# EAGLE design circuitcop (EAGLE 8.5.0)
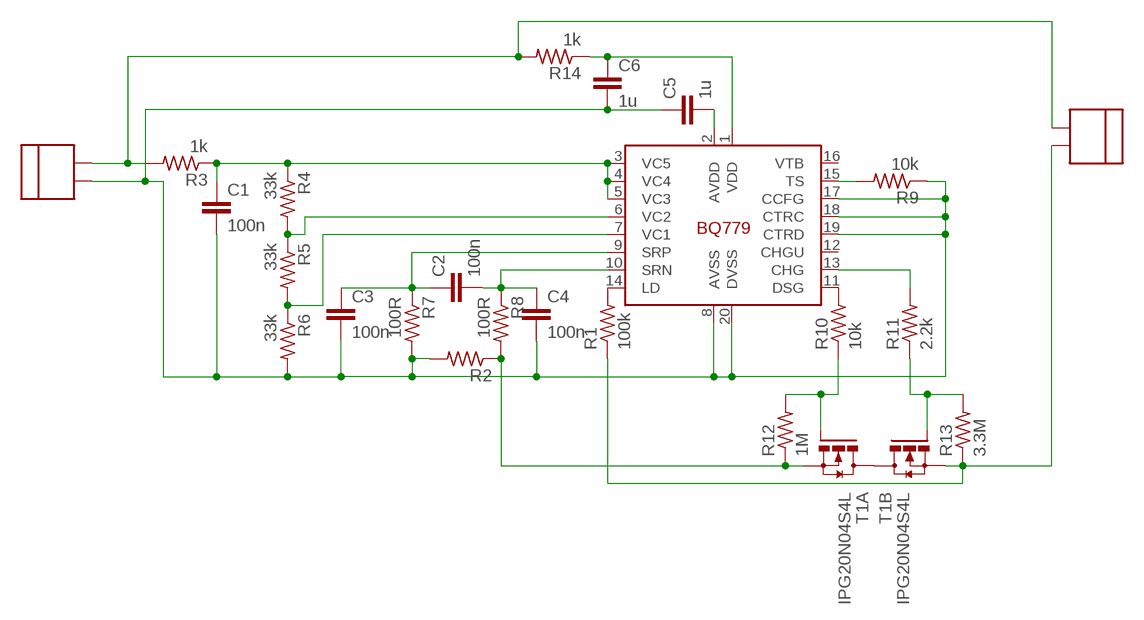
[diagram p0: schematic, sheet 1]

## Parts
C1  100n  C-EUC0805  [C0805]
C2  100n  C-EUC0805  [C0805]
C3  100n  C-EUC0805  [C0805]
C4  100n  C-EUC0805  [C0805]
C5  1u  C-EUC0805  [C0805]
C6  1u  C-EUC0805  [C0805]
R1  100k  R-US_R0805  [R0805]
R2  R-US_R1206  [R1206]
R3  1k  R-US_R0805  [R0805]
R4  33k  R-US_R0805  [R0805]
R5  33k  R-US_R0805  [R0805]
R6  33k  R-US_R0805  [R0805]
R7  100R  R-US_R0805  [R0805]
R8  100R  R-US_R0805  [R0805]
R9  10k  R-US_R0805  [R0805]
R10  10k  R-US_R0805  [R0805]
R11  2.2k  R-US_R0805  [R0805]
R12  1M  R-US_R0805  [R0805]
R13  3.3M  R-US_R0805  [R0805]
R14  1k  R-US_R0805  [R0805]
T1  IPG20N04S4L  [PG-TDSON-8]
U1  BQ779  [TSSOP20]
U$1  CTB5202/2  [CTB5202/2]
U$2  CTB5202/2  [CTB5202/2]

## Nets
GND: C1.2 C3.2 C4.2 C5.1 C6.2 R2.2 R6.2 R7.2 R9.1 U1.8(AVSS) U1.17(CCFG) U1.18(CTRC) U1.19(CTRD) U1.20(DVSS) U$1.P$1
N$1: R4.2 R5.1 U1.6(VC2)
N$2: R5.2 R6.1 U1.7(VC1)
N$3: C2.1 C3.1 R7.1 U1.9(SRP)
N$4: C2.2 C4.1 R8.1 U1.10(SRN)
N$5: C1.1 R3.1 R4.1 U1.3(VC5) U1.4(VC4) U1.5(VC3)
N$7: R2.1 R8.2 R12.1 T1.1(A:S)
N$8: R1.2 U1.14(LD)
N$10: R10.2 U1.11(DSG)
N$11: R9.2 U1.15(TS)
N$12: T1.5(B:D) T1.6(B:D) T1.7(A:D) T1.8(A:D) T1.TH1(B:D) T1.TH2(A:D)
N$13: R10.1 R12.2 T1.2(A:G)
N$14: R11.2 U1.13(CHG)
N$15: R11.1 R13.2 T1.4(B:G)
N$16: C5.2 U1.2(AVDD)
N$17: R1.1 R13.1 T1.3(B:S) U$2.P$2
N$18: C6.1 R14.1 U1.1(VDD)
VIN: R3.2 R14.2 U$1.P$2 U$2.P$1
Unconnected: U1.12(CHGU) U1.16(VTB)

## Library data of the parts
C1-C6 = rcl:C-EU: CAPACITOR, European symbol; SPICEPREFIX: C
R1-R14 = misc:R-US_: RESISTOR, American symbol
T1 = IPG20N04S4L:IPG20N04S4L: Dual N-channel MOSFET. 20A, Vds,max=40V, Rdson,max=8.2mR Datasheet at Farnell <http://www.farnell.com/datasheets/1932535.pdf?_ga=2.17787385.1360937002.1515340557-241923561.1513546305&_gac=1.22370633.1514846378.Cj0KCQiA1afSBRD2ARIsAEvBsNl_y5JmDMBzAF42O03K2v0vVKA9sTXvKaycQKQC2h6kTph-o7M1zWkaAg_oEALw_wcB>
U1 = BQ779:BQ779: TI BQ77904/BQ77905 Lithium protection IC
U$1 U$2 = CTB5202:CTB5202/2

## Board
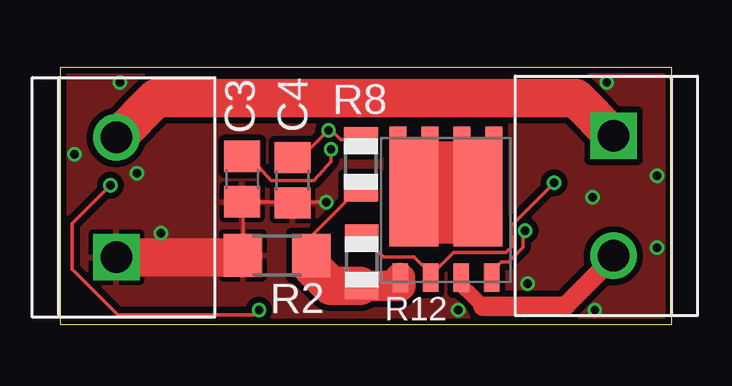
[diagram p1: board, top side]
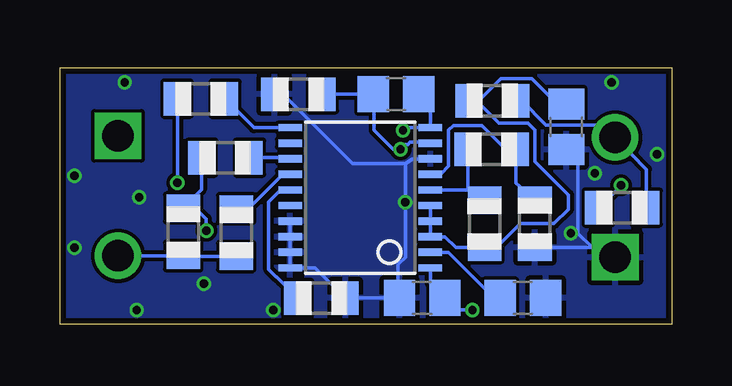
[diagram p2: board, bottom side, seen from below]

Size 25.5 x 10.7 mm. Coordinates in mm from the lower left corner, seen from the top.
Outline: 0,0 25.5,0 25.5,10.7 0,10.7 0,0
Copper layers (1*16): Top 0.018mm / dielectric 1.55mm / Bottom 0.018mm
Design rules "eurocircuit": minimum track width 0.15mm, minimum drill 0.35mm, track to track 0.15mm, track to pad 0.15mm, pad to pad 0.15mm, via to via 0.15mm, smd to smd 0mil, copper to edge 0.25mm, drill to drill 0.35mm, minimum pad ring 0.175mm, minimum via ring 0.125mm, stop-mask expansion 0mil, vias tented up to drill 0.45mm, thermal gap 0.2mm

### Footprints (pad centres in the part's own frame; a part is rotated, then mirrored left to right if it is on the bottom)
C0805 = smd 1.3 x 1.5: 1 -0.95,0; 2 0.95,0
R0805 = smd 1.1 x 1.4: 1 -1,0; 2 1,0
R1206 = smd 1.6 x 1.803: 1 -1.422,0; 2 1.422,0
PG-TDSON-8 = smd 1.2 x 0.65: 1 -2.825,1.905; 2 -2.825,0.635; 3 -2.825,-0.635; 4 -2.825,-1.905 | smd 1 x 0.7: 5 2.975,-2; 6 2.975,-0.665; 7 2.975,0.665; 8 2.975,2 | smd 4.5 x 2.035: TH1 0.725,-1.333; TH2 0.725,1.333
TSSOP20 = smd 0.305 x 0.991: 1 -2.925,-2.918; 2 -2.275,-2.918; 3 -1.625,-2.918; 4 -0.975,-2.918; 5 -0.325,-2.918; 6 0.325,-2.918; 7 0.975,-2.918; 8 1.625,-2.918; 9 2.275,-2.918; 10 2.925,-2.918; 11 2.925,2.918; 12 2.275,2.918; 13 1.625,2.918; 14 0.975,2.918; 15 0.325,2.918; 16 -0.325,2.918; 17 -0.975,2.918; 18 -1.625,2.918; 19 -2.275,2.918; 20 -2.925,2.918
CTB5202/2 = drill 1.3 square: P$1 2.5,4.1 | drill 1.3: P$2 7.5,4.1

### Placement (x,y rotation side)
C1  4.39,8.24 270 bottom
C2  11.49,9.6 0 bottom
C3  7.6,6.06 270 top
C4  9.7,6.01 270 top
C5  6.2,1.1 180 bottom
C6  10.4,1.1 180 bottom
R1  18.15,3.83 90 bottom
R2  9.05,2.87 180 top
R3  7.47,9.33 0 bottom
R4  7.8,4.2 90 bottom
R5  7.5,7.3 0 bottom
R6  5.7,4.2 270 bottom
R7  15.56,9.6 180 bottom
R8  12.55,6.68 270 top
R9  14.6,1.1 180 bottom
R10  19.62,9.41 0 bottom
R11  18.6,6.95 0 bottom
R12  12.58,2.61 90 top
R13  20.36,3.86 90 bottom
R14  2.06,4.87 0 bottom
T1  16.09,4.77 90 top
U1  12.98,5.28 90 bottom
U$1  6.45,0.3 90 top
U$2  18.98,10.36 270 top

### Tracks (layer width: path | path; a pad name or v marks a point on that pad's centre or on a via)
GND  (via drill 0.35)
  Top 0.152: 9.7,5.1 9.7,5.11 C3.2 7.63,5.11 7.63,2.8 | v11.1,5.1 9.7,5.1 | 9.7,5.1 C4.2
  Top 1.27: 7.63,2.8 R2.2
  Top 1.6: U$1.P$1 7.63,2.8
  Bottom 0.152: U$1.P$1 2.8,3.2 3.3,3.2 | U1.17 U1.18 U1.19 U1.20 14.86,2.35 R9.1 11.4,1.1 | 11.4,1.1 11.4,2.5 11.1,2.8 v11.1,5.1 11.1,6.7 | 11.4,1.1 C6.2 | 11.1,6.7 10.8,6.9 10.1,6.9 U1.8 | R7.2 16.2,9.6 13.3,6.7 11.1,6.7 | 3.3,3.2 3.9,3.8 3.9,7.2 4,7.3 4.3,7.3 C1.2 | R6.2 3.3,3.2
  other vias: 4.2,3.8 0.6,7.1 2.5,10.1 3.2,6.3 19.5,1.7 22.3,0.6 24.9,3.2 24.9,6.2 22.2,5.3 22.8,10.1 16.6,0.6
  pour Top (isolate 0.254): -2.5,12 29.1,12 29.1,-1.6 -2.5,-1.6 -2.5,11.9
  pour Bottom: -0.1,10.8 -0.1,-0.1 25.8,-0.1 25.8,10.8
N$1
  Bottom 0.152: R4.2 8.5,5.6 | 8.5,5.6 R5.1 | 8.5,5.6 9.29,5.61 U1.6
N$2
  Bottom 0.152: R6.1 6.5,5.9 R5.2 6.9,7.3 7.9,8.3 9.1,8.3 9.3,8.1 9.3,6.6 9.6,6.3 10,6.3 U1.7
N$3  (via drill 0.35)
  Top 0.152: 8,7 C3.1 8.1,7 8.1,6.8 8.8,6 10.6,6 11.3,6.8 v11.3,7.3
  Bottom 0.152: R7.1 C2.1 12.4,9.6 12.4,8.1 11.6,7.3 v11.3,7.3 11.1,7.5 11,7.5 10.9,7.6 10.1,7.6 U1.9
N$4  (via drill 0.35)
  Top 0.152: R8.1 12.5,7.7 11.7,7.7 11.3,8.1 v11.2,8.1 10.1,7 9.7,7 C4.1
  Bottom 0.152: C2.2 10.06,9.12 U1.10 10.1,8.2 11.1,8.2 v11.2,8.1
N$5
  Bottom 0.152: U1.5 U1.4 U1.3 9.46,3.65 9,3.2 R4.1 7.3,3.2 6.3,4.2 4.9,4.2 4.3,4.8 4.3,5.4 5.7,6.8 5.7,8.1 6,8.4 7.2,8.4 8.1,9.3 R3.1 8.04,9.33 7.11,10.26 5.83,10.26 4.76,9.19 C1.1
N$7
  Top 0.152: R2.1 10.5,3.5 10.5,3.7 12.4,5.6 12.4,5.7 12.5,5.7 R8.2
  Top 1.27: 10.5,2.4 10.5,2.8 R2.1 | 12.5,1.6 R12.1 13.2,1.6 14.2,1.6 T1.1
  Top 1.6: 10.5,2.4 11.3,1.6 12.5,1.6
N$8
  Bottom 0.152: U1.14 16.17,6.28 16.49,5.98 17.64,4.83 R1.2
N$10
  Bottom 0.152: U1.11 17.41,8.21 R10.2
N$11
  Bottom 0.152: R9.2 16.48,1.98 16.49,1.98 16.8,2.29 16.8,5.1 16.3,5.61 U1.15
N$12
  Top 0.152: T1.6 16.8,7.7 16.8,7.1 T1.TH1 17.6,6.7 17.8,6.7 18.1,7 18.1,7.7 T1.5 | T1.7 15.4,7.7 15.4,7.1 T1.TH2 14.4,6.8 14.1,7.1 14.1,7.7 T1.8
  Top 1.27: T1.TH2 15.16,7 17.1,7 16.9,4 | 16.9,4 14.7,4 | 16.9,4 15.72,6 T1.TH1
N$13  (via drill 0.35)
  Top 0.152: R12.2 13.48,2.81 14.77,2.81 15.63,1.95 T1.2 15.5,2.1 16.4,3 18.6,3 18.9,3.3 18.9,3.6 18.8,3.7 18.8,4.1 v20.6,5.9
  Bottom 0.152: v20.6,5.9 20.6,9.4 R10.1
N$14
  Bottom 0.152: R11.2 15.94,6.95 U1.13
N$15  (via drill 0.35)
  Top 0.152: 18.2,2.4 18.2,2 T1.4 18.2,2.4 | 18.2,2.4 18.4,2.6 18.7,2.6 19.3,3.2 19.3,3.8 v19.4,3.9
  Bottom 0.152: R11.1 19.6,5.62 R13.2 20.3,4.9 19.9,4.9 19.4,4.4 v19.4,3.9
N$16
  Bottom 0.152: 6.6,1.1 C5.2 7.4,1.1 9.3,3 10,3 U1.2
N$17
  Top 0.61: T1.3 16.71,1.66 17.21,1.16 17.63,0.74 | 21.05,0.74 21.1,0.8
  Top 0.813: 21.1,0.8 23,2.7 U$2.P$2 | 17.63,0.74 21.05,0.74
  Bottom 0.152: R1.1 20.33,2.83 R13.1 U$2.P$2
N$18  (via drill 0.35)
  Top 0.152: v2.1,5.8 0.5,4.2 0.5,2.3 2.4,0.4 8.1,0.4 v8.3,0.6
  Bottom 0.152: U1.1 10.06,1.71 C6.1 9.5,1.1 9.5,0.6 | v2.1,5.8 3,4.9 R14.1 | 9.5,0.6 v8.3,0.6 | 9.5,0.6 9.5,0.5
VIN
  Top 1.27: U$1.P$2 2.38,7.8
  Top 1.6: U$2.P$1 21.51,9.43 4.01,9.43 2.38,7.8
  Bottom 0.152: R14.2 1.05,6.46 2.27,7.72 | 2.27,7.72 U$1.P$2 | R3.2 6.25,9.33 5.23,8.31 2.87,8.31 2.27,7.72